# EAGLE design board (EAGLE 9.1.0)
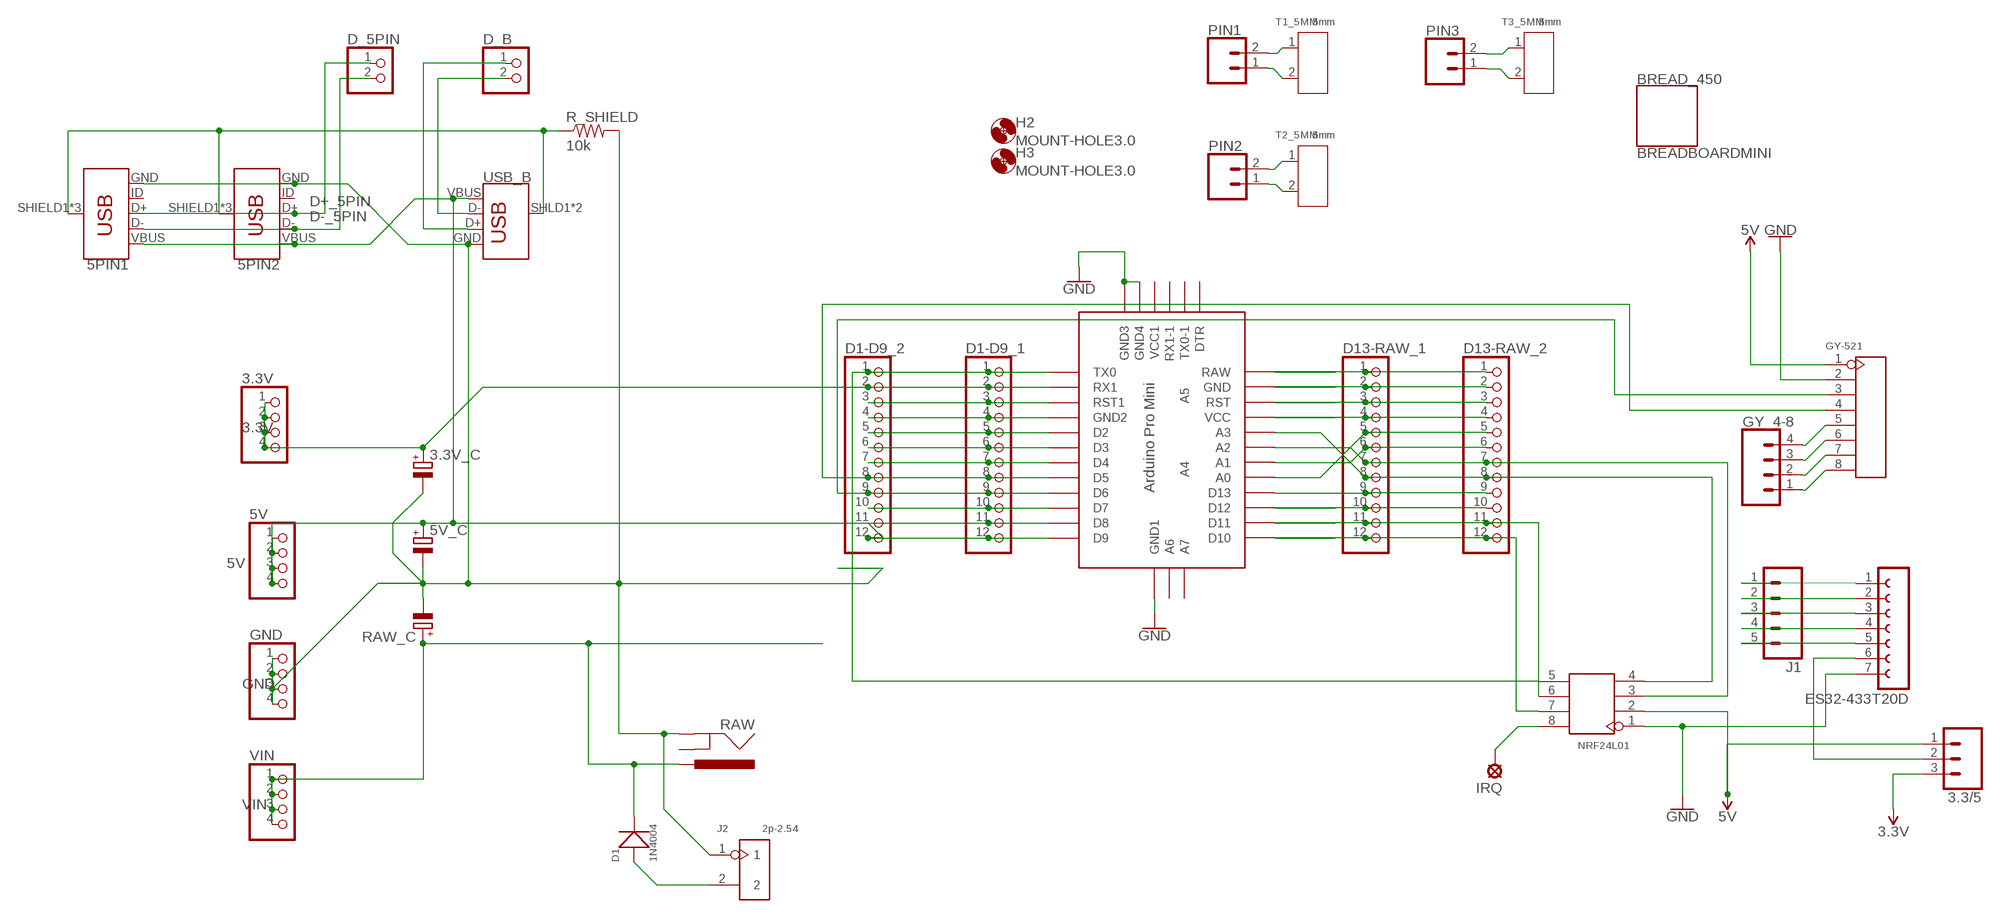
[diagram p0: schematic, sheet 1]

## Parts
3.3/5  CONN_03LOCK  [1X03_LOCK]
3.3V  PINHD-1X4  [1X04]
3.3V_C  CPOL-EUE2.5-5  [E2,5-5]
5PIN1  USB_MICRO-B_FEMALE-SMT  [USB-B-MICRO-SMD]
5PIN2  USB_MICRO-B_FEMALE-SMT  [USB-B-MICRO-SMD]
5V  PINHD-1X4  [1X04]
5V_C  CPOL-EUE3.5-8  [E3,5-8]
BREAD_450  BREADBOARDMINI  [BREADBOARD-MINI]
D1  1N4004  DIP-DIODE-400V-1A(DO-41)  [DO-41]
D1-D9_1  PINHD-1X12  [1X12]
D1-D9_2  PINHD-1X12  [1X12]
D13-RAW_1  PINHD-1X12  [1X12]
D13-RAW_2  PINHD-1X12  [1X12]
D_5PIN  PINHD-1X2  [1X02]
D_B  PINHD-1X2  [1X02]
ES32-433T20D  FE07-1  [FE07]
GND  PINHD-1X4  [1X04]
GY-521  DIP-BLACK-FEMALE-HEADER-VERT(8P-2.54)  [H8-2.54]
GY_4-8  CONN_04  [1X04]
H2  MOUNT-HOLE3.0  [3,0]
H3  MOUNT-HOLE3.0  [3,0]
IRQ  LSP10  [LSP10]
J1  CONN_05  [1X05]
J2  2p-2.54  DIP-BLACK-MALE-HEADER-VERT(2P-2.54)  [H2-2.54]
NRF24L01  DIP-BLACK-FEMALE-HEADER(2X4P-2.54)  [H2X4-2.54]
PIN1  CONN_02LOCK  [1X02_LOCK]
PIN2  CONN_02LOCK  [1X02_LOCK]
PIN3  CONN_02LOCK  [1X02_LOCK]
R_SHIELD  10k  R-US_0204/5  [0204/5]
RAW  POWER_JACKSLT  [POWER_JACK_SLOT]
RAW_C  CPOL-EUE3.5-8  [E3,5-8]
T1_5MM  5mm  SCREW-TERMINAL-GREEN(2P-5.0)  [H2-5.0-10.5X8.0MM]
T2_5MM  5mm  SCREW-TERMINAL-GREEN(2P-5.0)  [H2-5.0-10.5X8.0MM]
T3_5MM  5mm  SCREW-TERMINAL-GREEN(2P-5.0)  [H2-5.0-10.5X8.0MM]
U$1  ABK-PRO-MINI  [ABK-PRO-MINI]
USB_B  USB_B_PTH  [USB-B-PTH]
VIN  PINHD-1X4  [1X04]

## Nets
3.3V [power]: 3.3/5.3 3.3V.1 3.3V.2 3.3V.3 3.3V.4 3.3V_C.+ D1-D9_1.2 D1-D9_2.2 U$1.RX1
5V [power]: 3.3/5.1 5PIN1.VBUS 5PIN2.VBUS 5V.1 5V.2 5V.3 5V.4 5V_C.+ D1-D9_1.12 D1-D9_2.12 GY-521.1 NRF24L01.2 U$1.D9 USB_B.VBUS
A5: D1-D9_1.9 D1-D9_2.9 GY-521.3 U$1.D6
A6: D1-D9_1.10 D1-D9_2.10 U$1.D7
A7: D1-D9_1.11 D1-D9_2.11 U$1.D8
CE_NRF: D13-RAW_1.7 D13-RAW_2.7 NRF24L01.3 U$1.A2
CSN_NRF: D13-RAW_1.8 D13-RAW_2.8 NRF24L01.4 U$1.A3
D+_5PIN: 5PIN1.D+ 5PIN2.D+ D_5PIN.1
D+_B: D_B.1 USB_B.D+
D-_5PIN: 5PIN1.D- 5PIN2.D- D_5PIN.2
D-_B: D_B.2 USB_B.D-
GND [power]: 3.3V_C.- 5PIN1.GND 5PIN2.GND 5V_C.- ES32-433T20D.7 GND.1 GND.2 GND.3 GND.4 GY-521.2 J2.1 NRF24L01.1 R_SHIELD.2 RAW.GND@2(GND) RAW_C.- U$1.GND2(GND3) U$1.GND3(GND4) U$1.GND4(GND1) USB_B.GND
MISO_NRF: D13-RAW_1.12 D13-RAW_2.12 NRF24L01.7 U$1.D10
MOSI_NRF: D13-RAW_1.11 D13-RAW_2.11 NRF24L01.6 U$1.D11
N$1: IRQ.MP NRF24L01.8
N$2: GY-521.5 GY_4-8.4
N$3: D1-D9_1.3 D1-D9_2.3 U$1.RST1
N$4: D1-D9_1.4 D1-D9_2.4 U$1.GND1(GND2)
N$5: D1-D9_1.5 D1-D9_2.5 U$1.D2
N$6: D1-D9_1.6 D1-D9_2.6 U$1.D3
N$7: D1-D9_1.7 D1-D9_2.7 U$1.D4
N$8: GY-521.6 GY_4-8.3
N$9: GY-521.7 GY_4-8.2
N$10: GY-521.8 GY_4-8.1
N$11: 3.3/5.2 ES32-433T20D.6
N$12: ES32-433T20D.1 J1.1
N$13: ES32-433T20D.2 J1.2
N$14: ES32-433T20D.3 J1.3
N$15: ES32-433T20D.4 J1.4
N$16: D13-RAW_1.1 D13-RAW_2.1 U$1.RAW
N$17: D13-RAW_1.2 D13-RAW_2.2 U$1.GND
N$18: D13-RAW_1.3 D13-RAW_2.3 U$1.RST
N$19: D13-RAW_1.4 D13-RAW_2.4 U$1.VCC
N$20: D13-RAW_1.5 D13-RAW_2.5 U$1.A0
N$21: D13-RAW_1.6 D13-RAW_2.6 U$1.A1
N$22: ES32-433T20D.5 J1.5
N$23 [terminal]: PIN1.2 T1_5MM.1
N$24: D1.1(+) J2.2
N$25: D13-RAW_1.10 D13-RAW_2.10 U$1.D12
N$26 [terminal]: PIN1.1 T1_5MM.2
N$27 [terminal]: PIN2.2 T2_5MM.1
N$29: D13-RAW_1.9 D13-RAW_2.9 U$1.D13
N$31 [terminal]: PIN2.1 T2_5MM.2
N$32 [terminal]: PIN3.2 T3_5MM.1
N$33 [terminal]: PIN3.1 T3_5MM.2
SCK_NRF: D1-D9_1.1 D1-D9_2.1 NRF24L01.5 U$1.TX0
SDA_GY521: D1-D9_1.8 D1-D9_2.8 GY-521.4 U$1.D5
SHIELD_IN [power]: 5PIN1.SHIELD1(SHIELD) 5PIN1.SHIELD2(SHIELD) 5PIN1.SHIELD3(SHIELD) 5PIN2.SHIELD1(SHIELD) 5PIN2.SHIELD2(SHIELD) 5PIN2.SHIELD3(SHIELD) R_SHIELD.1 USB_B.SHLD1(SHIELD) USB_B.SHLD2(SHIELD)
VIN [power]: D1.2(-) RAW.PWR RAW_C.+ VIN.1 VIN.2 VIN.3 VIN.4
Unconnected: 5PIN1.ID 5PIN2.ID RAW.GND@1(GNDBREAK) U$1.A4 U$1.A5 U$1.A6 U$1.A7 U$1.DTR U$1.RX1-1 U$1.TX0-1 U$1.VCC1

## Library data of the parts
3.3/5 = SparkFun-Connectors:CONN_03: Multi connection point. Often used as Generic Header-pin footprint for 0.1 inch spaced/style header connections On any of the 0.1 inch spaced packages, you can populate with these: Break Away Headers - Straight <https://www.sparkfun.com/products/116> (PRT-00116) Break Away Male Headers - Right Angle <https://www.sparkfun.com/products/553> (PRT-00553) Female Headers <https://www.sparkfun.com/products/115> (PRT-00115) Break Away Headers - Machine Pin <https://www.sparkfun.com/products/117> (PRT-00117) Break Away Female Headers - Swiss Machine Pin <https://www.sparkfun.com/products/743> (PRT-00743) Stackable Header - 3 Pin (Female, 0.1") <https://www.sparkfun.com/products/13875> (PRT-13875) For SCREWTERMINALS and SPRING TERMINALS visit here: Screw Terimnals on SparkFun.com <https://www.sparkfun.com/search/results?term=Screw+Terminals> (5mm/3.5mm/2.54mm spacing) This device is also useful as a general connection point to wire up your design to another part of your project. Our various solder wires solder well into these plated through hole pads. Hook-Up Wire - Assortment (Stranded, 22 AWG) <https://www.sparkfun.com/products/11375> (PRT-11375) Hook-Up Wire - Assortment (Solid Core, 22 AWG) <https://www.sparkfun.com/products/11367> (PRT-11367) View the entire wire category on our website here <https://www.sparkfun.com/categories/141> Special notes: Molex polarized connector foot print use with SKU : PRT-08232 with associated crimp pins and housings.
3.3V 5V GND VIN = pinhead:PINHD-1X4: PIN HEADER
3.3V_C = rcl:CPOL-EU: POLARIZED CAPACITOR, European symbol; SPICEPREFIX: C
5PIN1 5PIN2 = SparkFun-Connectors:USB_MICRO-B: USB Type Micro-B Connector Male/female and PTH/SMT variants SparkFun Products: SparkFun microB USB Breakout <https://www.sparkfun.com/products/12035> SparkFun USB microB Plug Breakout <https://www.sparkfun.com/products/10031> SparkFun ESP8266 Thing <https://www.sparkfun.com/products/13231>; PROD_ID: CONN-11752
5V_C RAW_C = resistor:CPOL-EU: POLARIZED CAPACITOR, European symbol
BREAD_450 = SparkFun-Boards:BREADBOARD: SparkFun Breadboard Mini This is the mechnical outline for the very small self adhesive breadboard from SparkFun Electronics and our prototyping breadboard of the same size. Good for very small proto areas. SparkFun Products: White <https://www.sparkfun.com/products/7916> Green <https://www.sparkfun.com/products/12046> Black <https://www.sparkfun.com/products/12047> Red <https://www.sparkfun.com/products/12044> Blue <https://www.sparkfun.com/products/12045> SparkFun Solder-able Breadboard-Mini <https://www.sparkfun.com/products/12702>; PROD_ID: COMP-12034
D1 = Seeed-Diode:DIP-DIODE-400V-1A(DO-41): 304010008; MPN: 1N4004
D1-D9_1 D1-D9_2 D13-RAW_1 D13-RAW_2 = pinhead:PINHD-1X12: PIN HEADER
D_5PIN D_B = pinhead:PINHD-1X2: PIN HEADER
ES32-433T20D = con-lsta:FE07-1: FEMALE HEADER; OC_FARNELL: unknown; OC_NEWARK: unknown
GY-521 = Seeed-Connector:DIP-BLACK-FEMALE-HEADER-VERT(8P-2.54): 320030061; MPN: F185-1108A1BSYC1; VALUE: 8p-2.54
GY_4-8 = SparkFun-Connectors:CONN_04: Multi connection point. Often used as Generic Header-pin footprint for 0.1 inch spaced/style header connections On any of the 0.1 inch spaced packages, you can populate with these: Break Away Headers - Straight <https://www.sparkfun.com/products/116> (PRT-00116) Break Away Male Headers - Right Angle <https://www.sparkfun.com/products/553> (PRT-00553) Female Headers <https://www.sparkfun.com/products/115> (PRT-00115) Break Away Headers - Machine Pin <https://www.sparkfun.com/products/117> (PRT-00117) Break Away Female Headers - Swiss Machine Pin <https://www.sparkfun.com/products/743> (PRT-00743) For SCREWTERMINALS and SPRING TERMINALS visit here: Screw Terimnals on SparkFun.com <https://www.sparkfun.com/search/results?term=Screw+Terminals> (5mm/3.5mm/2.54mm spacing) This device is also useful as a general connection point to wire up your design to another part of your project. Our various solder wires solder well into these plated through hole pads. Hook-Up Wire - Assortment (Stranded, 22 AWG) <https://www.sparkfun.com/products/11375> (PRT-11375) Hook-Up Wire - Assortment (Solid Core, 22 AWG) <https://www.sparkfun.com/products/11367> (PRT-11367) View the entire wire category on our website here <https://www.sparkfun.com/categories/141> Special notes: Molex polarized connector foot print use with SKU : PRT-08231 with associated crimp pins and housings. 1MM SMD Version SKU: PRT-10208; PROD_ID: CONN-09696
H2 H3 = holes:MOUNT-HOLE: MOUNTING HOLE with drill center marker
IRQ = solpad:LSP10: SOLDER PAD drill 1.0 mm, distributor Buerklin, 12H555
J1 = SparkFun-Connectors:CONN_05: Multi connection point. Often used as Generic Header-pin footprint for 0.1 inch spaced/style header connections On any of the 0.1 inch spaced packages, you can populate with these: Break Away Headers - Straight <https://www.sparkfun.com/products/116> (PRT-00116) Break Away Male Headers - Right Angle <https://www.sparkfun.com/products/553> (PRT-00553) Female Headers <https://www.sparkfun.com/products/115> (PRT-00115) Break Away Headers - Machine Pin <https://www.sparkfun.com/products/117> (PRT-00117) Break Away Female Headers - Swiss Machine Pin <https://www.sparkfun.com/products/743> (PRT-00743) For SCREWTERMINALS and SPRING TERMINALS visit here: Screw Terimnals on SparkFun.com <https://www.sparkfun.com/search/results?term=Screw+Terminals> (5mm/3.5mm/2.54mm spacing) This device is also useful as a general connection point to wire up your design to another part of your project. Our various solder wires solder well into these plated through hole pads. Hook-Up Wire - Assortment (Stranded, 22 AWG) <https://www.sparkfun.com/products/11375> (PRT-11375) Hook-Up Wire - Assortment (Solid Core, 22 AWG) <https://www.sparkfun.com/products/11367> (PRT-11367) View the entire wire category on our website here <https://www.sparkfun.com/categories/141> Special notes: Molex polarized connector foot print use with SKU : PRT-08231 with associated crimp pins and housings. 1MM SMD Version SKU: PRT-10208
J2 = Seeed-Connector:DIP-BLACK-MALE-HEADER-VERT(2P-2.54): 320020016; MPN: P125-1102A0BS116A1
NRF24L01 = Seeed-Connector:DIP-BLACK-FEMALE-HEADER(2X4P-2.54): 320030087; VALUE: 2X4P-2.54
PIN1-PIN3 = SparkFun-Connectors:CONN_02: Multi connection point. Often used as Generic Header-pin footprint for 0.1 inch spaced/style header connections On any of the 0.1 inch spaced packages, you can populate with these: Break Away Headers - Straight <https://www.sparkfun.com/products/116> (PRT-00116) Break Away Male Headers - Right Angle <https://www.sparkfun.com/products/553> (PRT-00553) Female Headers <https://www.sparkfun.com/products/115> (PRT-00115) Break Away Headers - Machine Pin <https://www.sparkfun.com/products/117> (PRT-00117) Break Away Female Headers - Swiss Machine Pin <https://www.sparkfun.com/products/743> (PRT-00743) For SCREWTERMINALS and SPRING TERMINALS visit here: Screw Terimnals on SparkFun.com <https://www.sparkfun.com/search/results?term=Screw+Terminals> (5mm/3.5mm/2.54mm spacing) This device is also useful as a general connection point to wire up your design to another part of your project. Our various solder wires solder well into these plated through hole pads. Hook-Up Wire - Assortment (Stranded, 22 AWG) <https://www.sparkfun.com/products/11375> (PRT-11375) Hook-Up Wire - Assortment (Solid Core, 22 AWG) <https://www.sparkfun.com/products/11367> (PRT-11367) View the entire wire category on our website here <https://www.sparkfun.com/categories/141> Special notes: Molex polarized connector foot print use with: PRT-08233 with associated crimp pins and housings. 2.54_SCREWTERM for use with PRT-10571. 3.5mm Screw Terminal footprints for PRT-08084 5mm Screw Terminal footprints for use with PRT-08432
R_SHIELD = resistor:R-US_: RESISTOR, American symbol
RAW = SparkFun-Connectors:POWER_JACK: Power Jack Connector This is the standard 5.5mm barrel jack for power. The PTH is the most common, proven, reliable, footprint. The Slot footprint only works if the mill layer is transmitted to the PCB fab house so be warned. Here are the connectors we sell at SparkFun: DC Barrel Power Jack/Connector <https://www.sparkfun.com/products/119> (PRT-00119) DC Barrel Power Jack/Connector (SMD) <https://www.sparkfun.com/products/12748> (PRT-12748) DC Barrel Jack Adapter - Breadboard Compatible <https://www.sparkfun.com/products/10811> (PRT-10811) It is used on this SparkFun product (and many, many others): SparkFun RedBoard - Programmed with Arduino <https://www.sparkfun.com/products/12757> (DEV-12757) Also, if you need a mating power supply or connector, please check these out: Wall Adapter Power Supply - 9VDC 650mA <https://www.sparkfun.com/products/298> (TOL-00298) DC Barrel Jack Adapter - Male <https://www.sparkfun.com/products/10287> (PRT-10287); PROD_ID: PRT-00119
T1_5MM T2_5MM T3_5MM = Seeed-Connector:SCREW-TERMINAL-GREEN(2P-5.0): 320110031; VALUE: GREEN-2P-5.0
U$1 = Arduino-clone:ABK-PRO-MINI: ABK Pro-Mini Arduino Clone
USB_B = SparkFun-Connectors:USB_B: USB Type B Connector SparkFun Products: SparkFun Stepoko <https://www.sparkfun.com/products/13899> PTH; PROD_ID: CONN-08278; SF_ID: PRT-00139

## Net classes
0 default: width 0.127 mm, drill 0.127 mm, clearance 0.127 mm
1 power: width 0.762 mm, clearance 0.305 mm
2 terminal: width 2.54 mm, clearance 0.305 mm

## Board
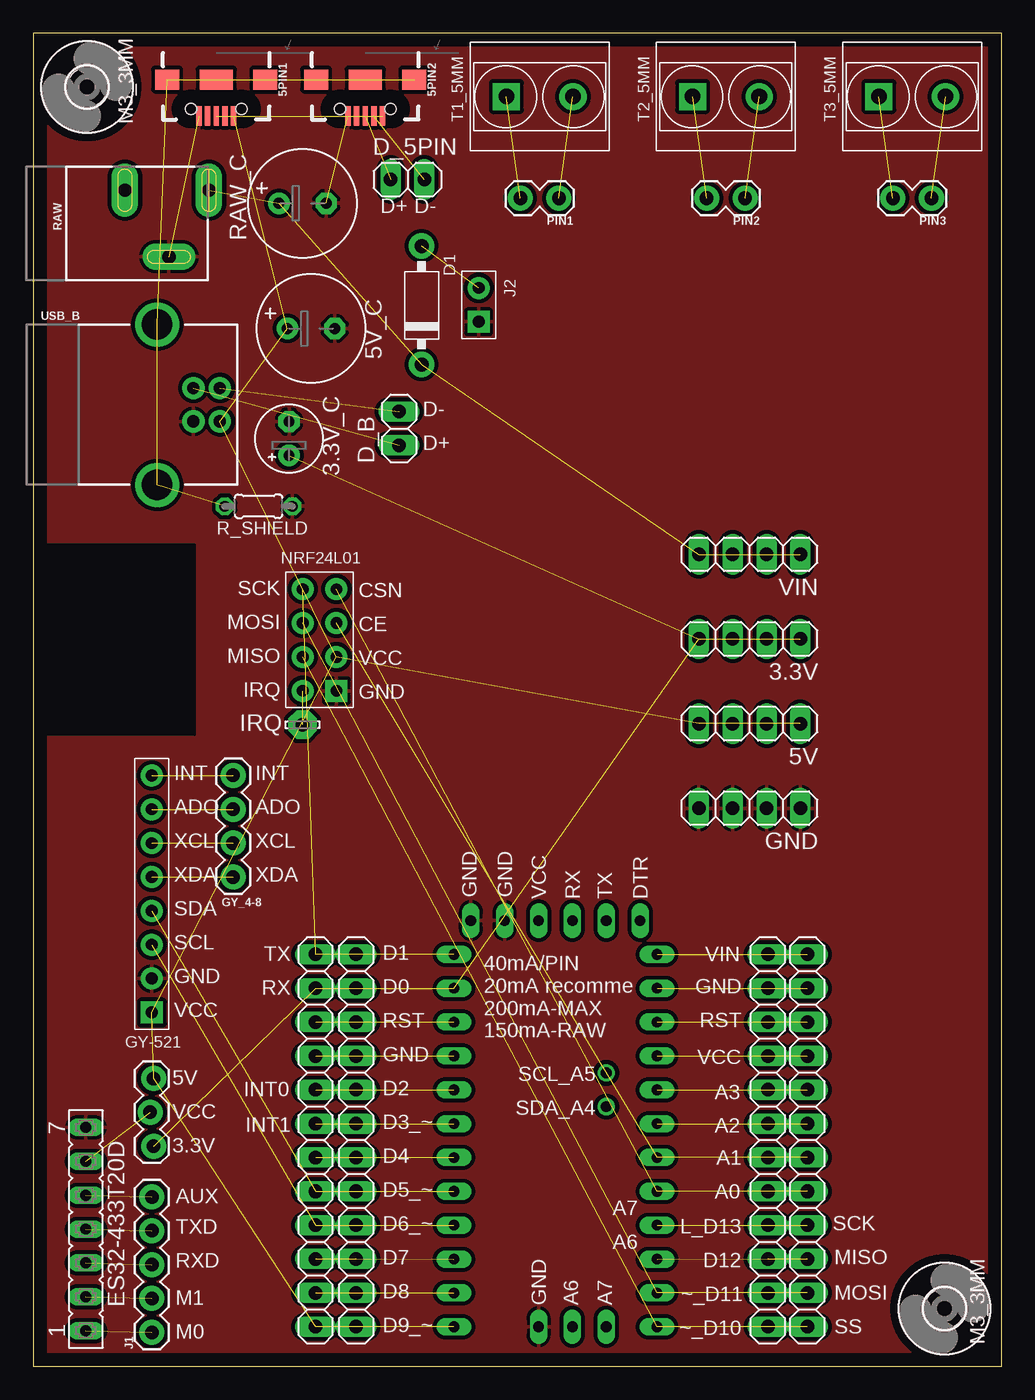
[diagram p1: board, top side]
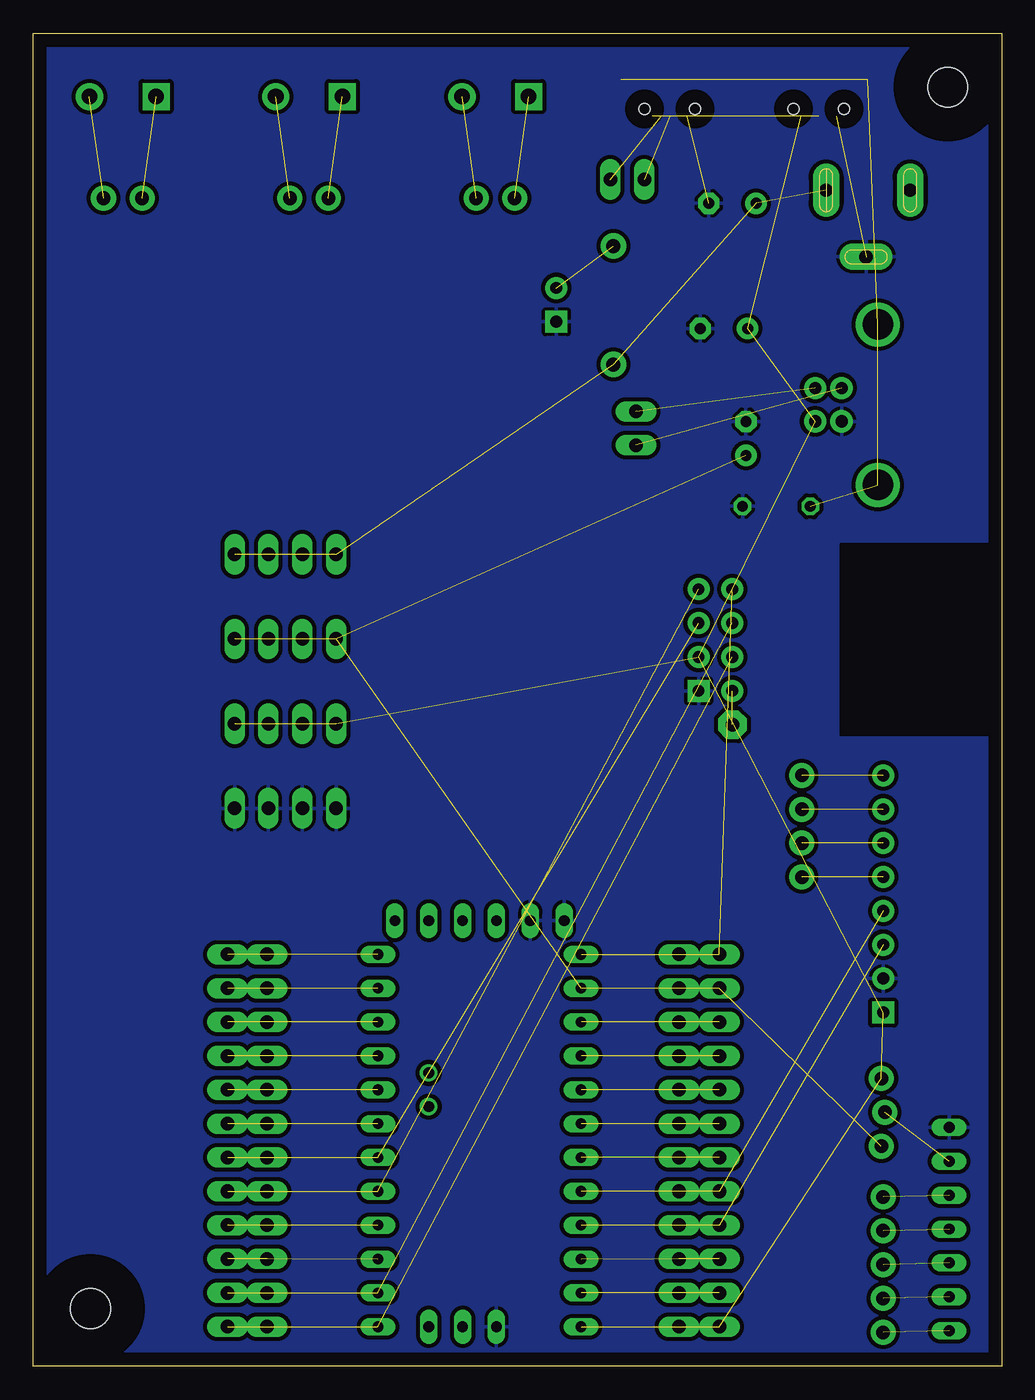
[diagram p2: board, bottom side, seen from below]

Size 72.62 x 100 mm. Coordinates in mm from the lower left corner, seen from the top.
Outline: 0,0 72.62,0 72.62,100 0,100 0,0
Copper layers (1*16): Top 0.035mm / dielectric 1.5mm / Bottom 0.035mm
Design rules "default": minimum track width 6mil, minimum drill 0.35mm, track to track 6mil, track to pad 6mil, pad to pad 6mil, via to via 6mil, smd to smd 6mil, copper to edge 40mil, drill to drill 6mil, minimum pad ring 10mil, minimum via ring 8mil, stop-mask expansion 4mil, vias tented up to drill 0mil, thermal gap 10mil
tRestrict: area 0.5,47.3 to 12.1,61.7
bRestrict: area 0.5,47.3 to 12.1,61.7

### Footprints (pad centres in the part's own frame; a part is rotated, then mirrored left to right if it is on the bottom)
1X03_LOCK = drill 1.016 pad 1.88: 1 0,0.127; 2 2.54,-0.127; 3 5.08,0.127
1X04 = drill 1.016 long: 1 -3.81,0; 2 -1.27,0; 3 1.27,0; 4 3.81,0
E2,5-5 = drill 0.813 pad 1.6: + -1.27,0 | drill 0.813 pad 1.6 octagon: - 1.27,0
USB-B-MICRO-SMD = smd 1.45 x 0.4: D+ 2.725,0; D- 2.725,0.65; GND 2.725,-1.3; ID 2.725,-0.65; VBUS 2.725,1.3 | smd 1.5 x 1.8: SHIELD1 0,3.685; SHIELD2 0,-3.685 | smd 1.5 x 2.5: SHIELD3 0,0 | hole 0.85: 2.2,1.9; 2.2,-1.9
E3,5-8 = drill 0.813 pad 1.6: + -1.778,0 | drill 0.813 pad 1.6 octagon: - 1.778,0
DO-41 = drill 1.041 pad 1.905: 1 -4.445,0; 2 4.445,0
1X12 = drill 1.016 long: 1 -13.97,0; 2 -11.43,0; 3 -8.89,0; 4 -6.35,0; 5 -3.81,0; 6 -1.27,0; 7 1.27,0; 8 3.81,0; 9 6.35,0; 10 8.89,0; 11 11.43,0; 12 13.97,0
1X02 = drill 1.016 long: 1 -1.27,0; 2 1.27,0
FE07 = drill 0.813 long: 1 -7.62,0; 2 -5.08,0; 3 -2.54,0; 4 0,0; 5 2.54,0; 6 5.08,0; 7 7.62,0
H8-2.54 = drill 0.889 pad 1.651 square: 1 0,8.89 | drill 0.889 pad 1.651: 2 0,6.35; 3 0,3.81; 4 0,1.27; 5 0,-1.27; 6 0,-3.81; 7 0,-6.35; 8 0,-8.89
1X04' = drill 1.016 pad 1.88: 1 0,0; 2 2.54,0; 3 5.08,0; 4 7.62,0
3,0 = hole 3: 0,0
LSP10 = drill 1.016 pad 2.159 octagon: MP 0,0
1X05 = drill 1.016 pad 1.88: 1 0,0; 2 2.54,0; 3 5.08,0; 4 7.62,0; 5 10.16,0
H2-2.54 = drill 0.889 pad 1.651 square: 1 0,1.27 | drill 0.889 pad 1.651: 2 0,-1.27
H2X4-2.54 = drill 0.889 pad 1.651 square: 1 -1.27,3.81 | drill 0.889 pad 1.651: 2 -1.27,1.27; 3 -1.27,-1.27; 4 -1.27,-3.81; 5 1.27,-3.81; 6 1.27,-1.27; 7 1.27,1.27; 8 1.27,3.81
1X02_LOCK = drill 1.016 pad 1.88: 1 -0.178,0; 2 2.718,0
0204/5 = drill 0.813 octagon: 1 -2.54,0; 2 2.54,0
POWER_JACK_SLOT = drill 1 pad 2 long: GND@1 2.58,7.5; GND@2 7.58,10.8; PWR 2.58,13.8
H2-5.0-10.5X8.0MM = drill 1.168 pad 2.032 square: 1 0,2.5 | drill 1.168 pad 2.032: 2 0,-2.5
ABK-PRO-MINI = drill 0.8 long: A0 10.16,-3.81; A1 10.16,-6.35; A2 10.16,-8.89; A3 10.16,-11.43; A6 3.81,-21.59; A7 6.35,-21.59; D2 -5.08,-3.81; D3 -5.08,-6.35; D4 -5.08,-8.89; D5 -5.08,-11.43; D6 -5.08,-13.97; D7 -5.08,-16.51; D8 -5.08,-19.05; D9 -5.08,-21.59; D10 10.16,-21.59; D11 10.16,-19.05; D12 10.16,-16.51; D13 10.16,-13.97; DTR 8.89,8.89; GND 10.16,3.81; GND1 -5.08,-1.27; GND2 -3.81,8.89; GND3 -1.27,8.89; GND4 1.27,-21.59; RAW 10.16,6.35; RST 10.16,1.27; RST1 -5.08,1.27; RX1 -5.08,3.81; RX1-1 3.81,8.89; TX0 -5.08,6.35; TX0-1 6.35,8.89; VCC 10.16,-1.27; VCC1 1.27,8.89 | drill 0.8: A4 6.35,-5.08; A5 6.35,-2.54
USB-B-PTH = drill 0.914 pad 1.676: D+ 4,1.25; D- 5.981,1.25; GND 4,-1.25; VBUS 5.981,-1.25 | drill 2.286: SHLD1 1.282,-6.02; SHLD2 1.282,6.02

### Placement (x,y rotation side)
3.3/5  8.89,21.59 270 top
3.3V  53.72,54.56 180 top
3.3V_C  19.18,69.6 90 top
5PIN1  13.72,96.52 270 top
5PIN2  24.89,96.52 270 top
5V  53.72,48.21 180 top
5V_C  20.83,77.85 0 top
BREAD_450  131.32,73.91 180 top  (outside the outline)
D1  29.12,79.6 270 top
D1-D9_1  21.17,16.93 270 top
D1-D9_2  24.2,16.93 270 top
D13-RAW_1  58.05,16.93 270 top
D13-RAW_2  55.09,16.93 270 top
D_5PIN  28.07,89.03 0 top
D_B  27.43,70.36 90 top
ES32-433T20D  3.94,10.29 90 top
GND  53.72,41.86 180 top
GY-521  8.89,35.43 180 top
GY_4-8  [1X04']  14.99,44.32 270 top
H2  68.33,4.32 0 top
H3  4.04,95.96 0 top
IRQ  20.19,48.13 180 top
J1  8.89,2.54 90 top
J2  33.4,79.63 180 top
NRF24L01  21.46,54.48 180 top
PIN1  39.24,87.63 180 top
PIN2  53.21,87.63 180 top
PIN3  67.18,87.63 180 top
R_SHIELD  16.89,64.52 0 top
RAW  -0.64,90.81 270 top
RAW_C  20.19,87.25 0 top
T1_5MM  37.97,95.25 90 top
T2_5MM  51.94,95.25 90 top
T3_5MM  65.91,95.25 90 top
U$1  36.62,24.55 0 top
USB_B  8,72.14 0 top
VIN  53.72,60.91 180 top

### Tracks (layer width: path | path; a pad name or v marks a point on that pad's centre or on a via)
3.3V  (8 unrouted)
5V  (13 unrouted)
A5  (3 unrouted)
A6  (2 unrouted)
A7  (2 unrouted)
CE_NRF  (3 unrouted)
CSN_NRF  (3 unrouted)
D+_5PIN  (2 unrouted)
D+_B  (1 unrouted)
D-_5PIN  (2 unrouted)
D-_B  (1 unrouted)
GND  (2 unrouted)
  pour Top: 85.09,99.95 85.09,0 0,0 0,99.95
  pour Bottom: 0,0 85.09,0.13 85.09,99.95 0,99.82
MISO_NRF  (3 unrouted)
MOSI_NRF  (3 unrouted)
N$1  (1 unrouted)
N$2  (1 unrouted)
N$3  (2 unrouted)
N$4  (2 unrouted)
N$5  (2 unrouted)
N$6  (2 unrouted)
N$7  (2 unrouted)
N$8  (1 unrouted)
N$9  (1 unrouted)
N$10  (1 unrouted)
N$11  (1 unrouted)
N$12  (1 unrouted)
N$13  (1 unrouted)
N$14  (1 unrouted)
N$15  (1 unrouted)
N$16  (2 unrouted)
N$17  (2 unrouted)
N$18  (2 unrouted)
N$19  (2 unrouted)
N$20  (2 unrouted)
N$21  (2 unrouted)
N$22  (1 unrouted)
N$23  (1 unrouted)
N$24  (1 unrouted)
N$25  (2 unrouted)
N$26  (1 unrouted)
N$27  (1 unrouted)
N$29  (2 unrouted)
N$31  (1 unrouted)
N$32  (1 unrouted)
N$33  (1 unrouted)
SCK_NRF  (3 unrouted)
SDA_GY521  (3 unrouted)
SHIELD_IN  (8 unrouted)
VIN  (6 unrouted)

### Text on the board
tPlace: M3_3MM | D+ | D- | D- | D+ | SCK | CSN | MOSI | CE | MISO | VCC | IRQ | GND | INT | INT | ADO | ADO | XCL | XCL | XDA | XDA | GND | GND | VCC | RX | TX | DTR | SDA | SCL | TX | VIN | D1 | GND | RX | GND | D0 | RST | VCC | RST | 40mA/PIN / 20mA recomme / 200mA-MAX / 150mA-RAW | VCC | GND | SCL_A5 | 5V | INT0 | A3 | D2 | SDA_A4 | VCC | INT1 | A2 | D3_~ | 3.3V | A1 | D4 | A0 | D5_~ | AUX | A7 | L_D13 | TXD | D6_~ | SCK | A6 | D12 | D7 | MISO | RXD | ~_D11 | M1 | D8 | GND | A6 | A7 | MOSI | D9_~ | ~_D10 | M0 | SS | M3_3MM
silktop: TOP
silkbottom: BOT